# EAGLE design prj3 (EAGLE 6.6.0)
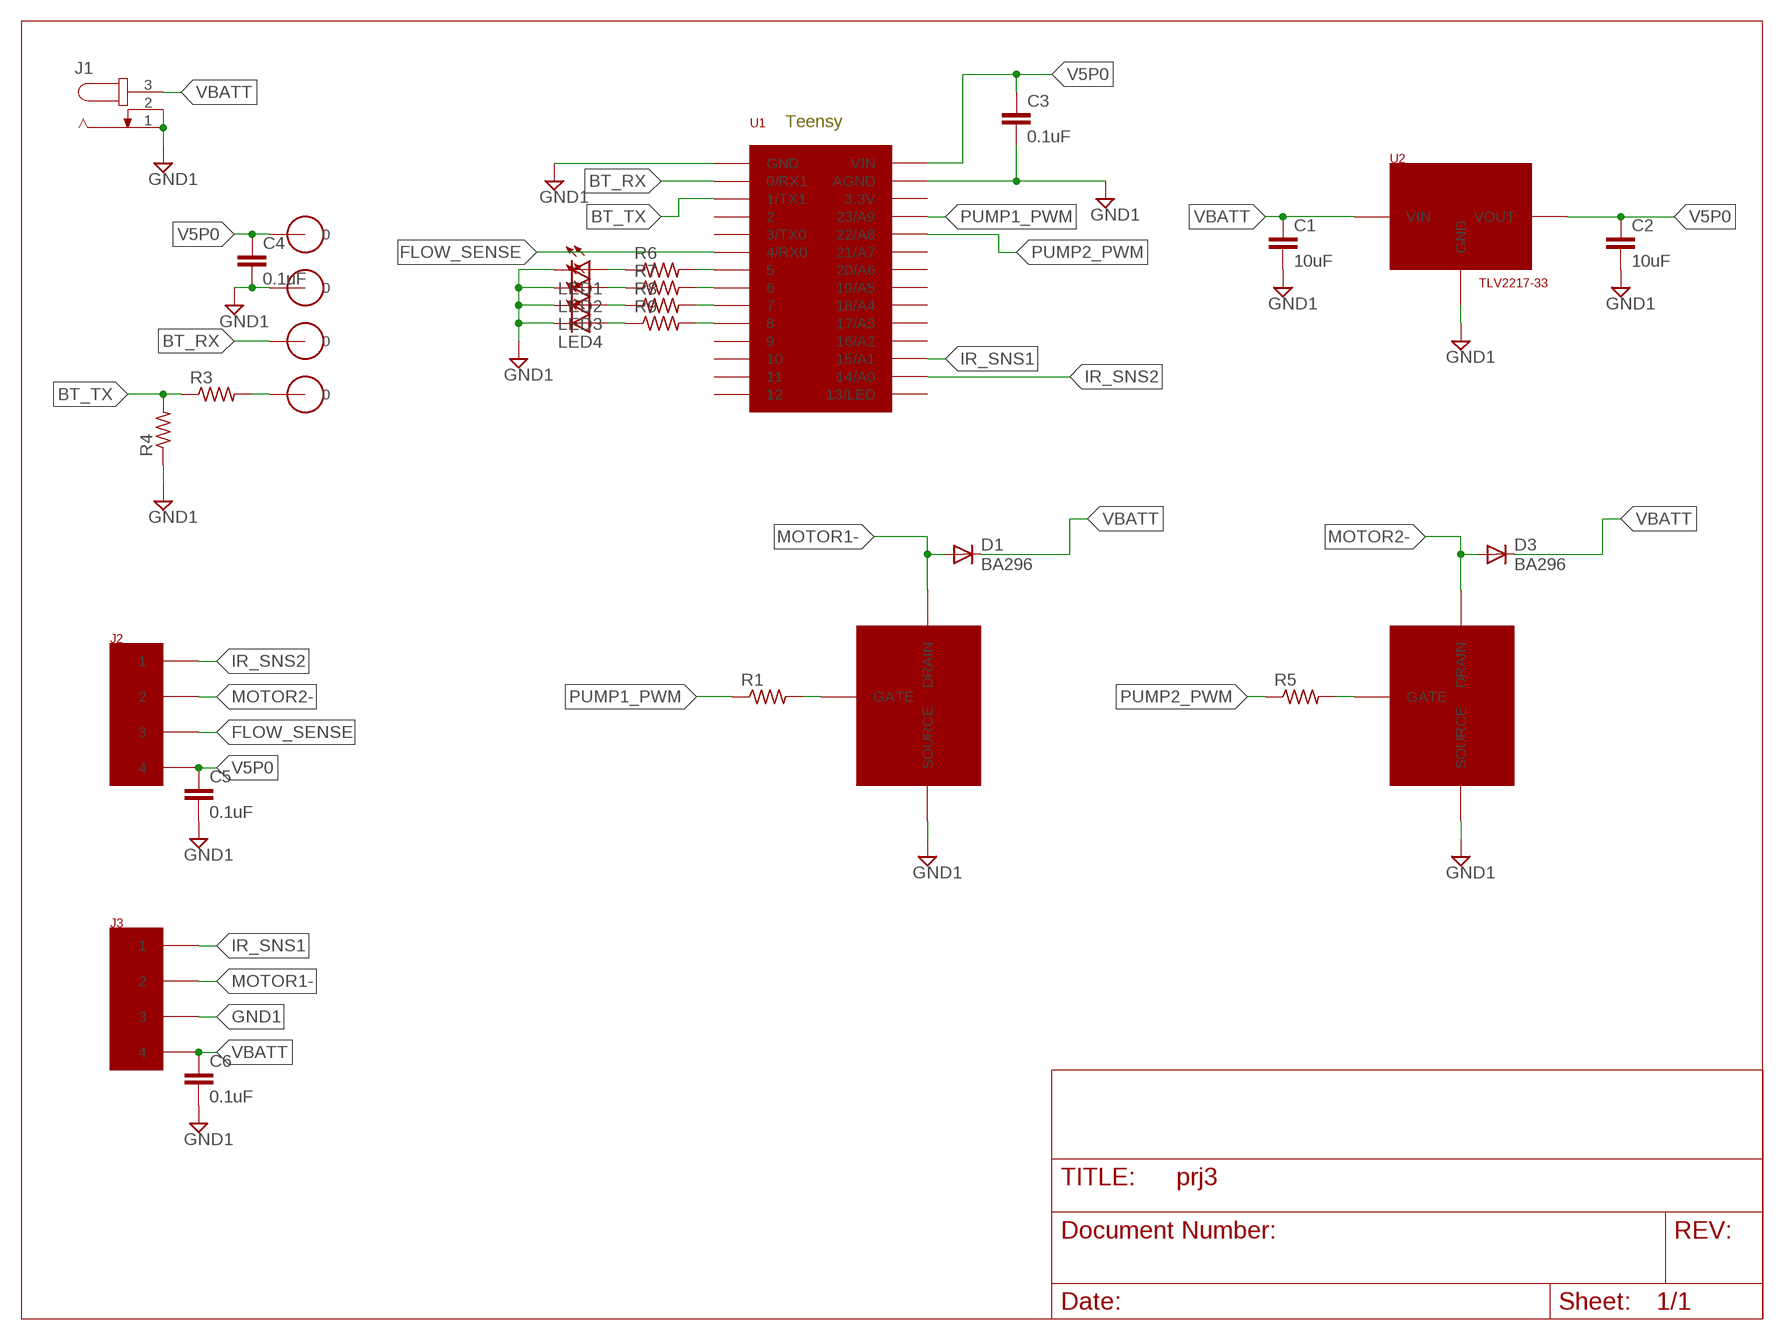
[diagram p0: schematic, sheet 1]

## Parts
C1  10uF  C2,5-3  [C2.5-3]
C2  10uF  C2,5-3  [C2.5-3]
C3  0.1uF  C2,5-3  [C2.5-3]
C4  0.1uF  C2,5-3  [C2.5-3]
C5  0.1uF  C2,5-3  [C2.5-3]
C6  0.1uF  C2,5-3  [C2.5-3]
D1  BA296  [P2-15]
D3  BA296  [P2-15]
J1  JACK-PLUG0  [SPC4077]
J2  1776119-4  [4P_SCREW_TERMINAL]
J3  1776119-4  [4P_SCREW_TERMINAL]
J7  35MIL_HOLE  [35MIL_HOLE]
J8  35MIL_HOLE  [35MIL_HOLE]
J9  35MIL_HOLE  [35MIL_HOLE]
J10  35MIL_HOLE  [35MIL_HOLE]
LED1  LED_ELD260  [LED_LD260]
LED2  LED_ELD260  [LED_LD260]
LED3  LED_ELD260  [LED_LD260]
LED4  LED_ELD260  [LED_LD260]
R1  R-US_0207/10  [0207/10]
R3  R-US_0207/10  [0207/10]
R4  R-US_0207/10  [0207/10]
R5  R-US_0207/10  [0207/10]
R6  R-US_0207/10  [0207/10]
R7  R-US_0207/10  [0207/10]
R8  R-US_0207/10  [0207/10]
R9  R-US_0207/10  [0207/10]
U1  TEENSY  [TEENSY]
U2  TLV2217-33  [TO-220]
U$2  NFET  [TO-220]
U$3  NFET  [TO-220]

## Nets
BT_RX: J9.P$1 U1.P$2(0/RX1)
BT_TX: R3.1 R4.2 U1.P$3(1/TX1)
FLOW_SENSE: J2.P$3 U1.P$6(4/RX0)
GND1: C1.2 C2.2 C3.2 C4.2 C5.2 C6.2 J1.1 J1.2 J3.P$3 J8.P$1 LED1.K(C) LED2.K(C) LED3.K(C) LED4.K(C) R4.1 U1.P$1(GND) U1.P$32(AGND) U2.2(GND) U$2.3(SOURCE) U$3.3(SOURCE)
IR_SNS1: J3.P$1 U1.P$22(15/A1)
IR_SNS2: J2.P$1 U1.P$21(14/A0)
MOTOR1-: D1.A J3.P$2 U$2.2(DRAIN)
MOTOR2-: D3.A J2.P$2 U$3.2(DRAIN)
N$4: R1.2 U$2.1(GATE)
N$6: R5.2 U$3.1(GATE)
N$7: R6.2 U1.P$7
N$8: J10.P$1 R3.2
N$9: R7.2 U1.P$8
N$10: R8.2 U1.P$9
N$11: R9.2 U1.P$10
N$12: LED1.A R6.1
N$13: LED2.A R7.1
N$14: LED3.A R8.1
N$15: LED4.A R9.1
PUMP1_PWM: R1.1 U1.P$30(23/A9)
PUMP2_PWM: R5.1 U1.P$29(22/A8)
V5P0: C2.1 C3.1 C4.1 C5.1 J2.P$4 J7.P$1 U1.P$33(VIN) U2.3(VOUT)
VBATT: C1.1 C6.1 D1.C D3.C J1.3 J3.P$4 U2.1(VIN)
Unconnected: U1.P$4 U1.P$5(3/TX0) U1.P$11 U1.P$12 U1.P$13 U1.P$14 U1.P$20(13/LED) U1.P$23(16/A2) U1.P$24(17/A3) U1.P$25(18/A4) U1.P$26(19/A5) U1.P$27(20/A6) U1.P$28(21/A7) U1.P$31(3.3V)

## Notes on the sheet
- Teensy

## Library data of the parts
C1-C6 = capacitor-wima:C: CAPACITOR naming: grid - package width
D1 D3 = diode:BA296: DIODE
J1 = mod:JACK-PLUG: DC POWER JACK Power Jack, DC, Right Angle, Through Hole, Rated 5A at 16VDC, PC Terminals Distributor: Farnell (www.Farnell.de) Drawing: 84N1161.pdf / 84N1162.pdf Manufacturer: SPC Technology (www.spctechnology.com) Type: SPC4077 / SPC 4078; OC_FARNELL: unknown; OC_NEWARK: unknown
J2 J3 = local:1776119-4
J7-J10 = local:35MIL_HOLE
LED1-LED4 = eagle-ltspice:LED_E: LED Source: http://www.osram.convergy.de Source: www.luxeon.com Source: www.kingbright.com; SPICEMODEL: NONE; SPICEPREFIX: D; SPICETYPE: diode
R1 R3-R9 = resistor:R-US_: RESISTOR, American symbol
U1 = local:TEENSY
U2 = local:TLV2217-33
U$2 U$3 = local:NFET

## Board
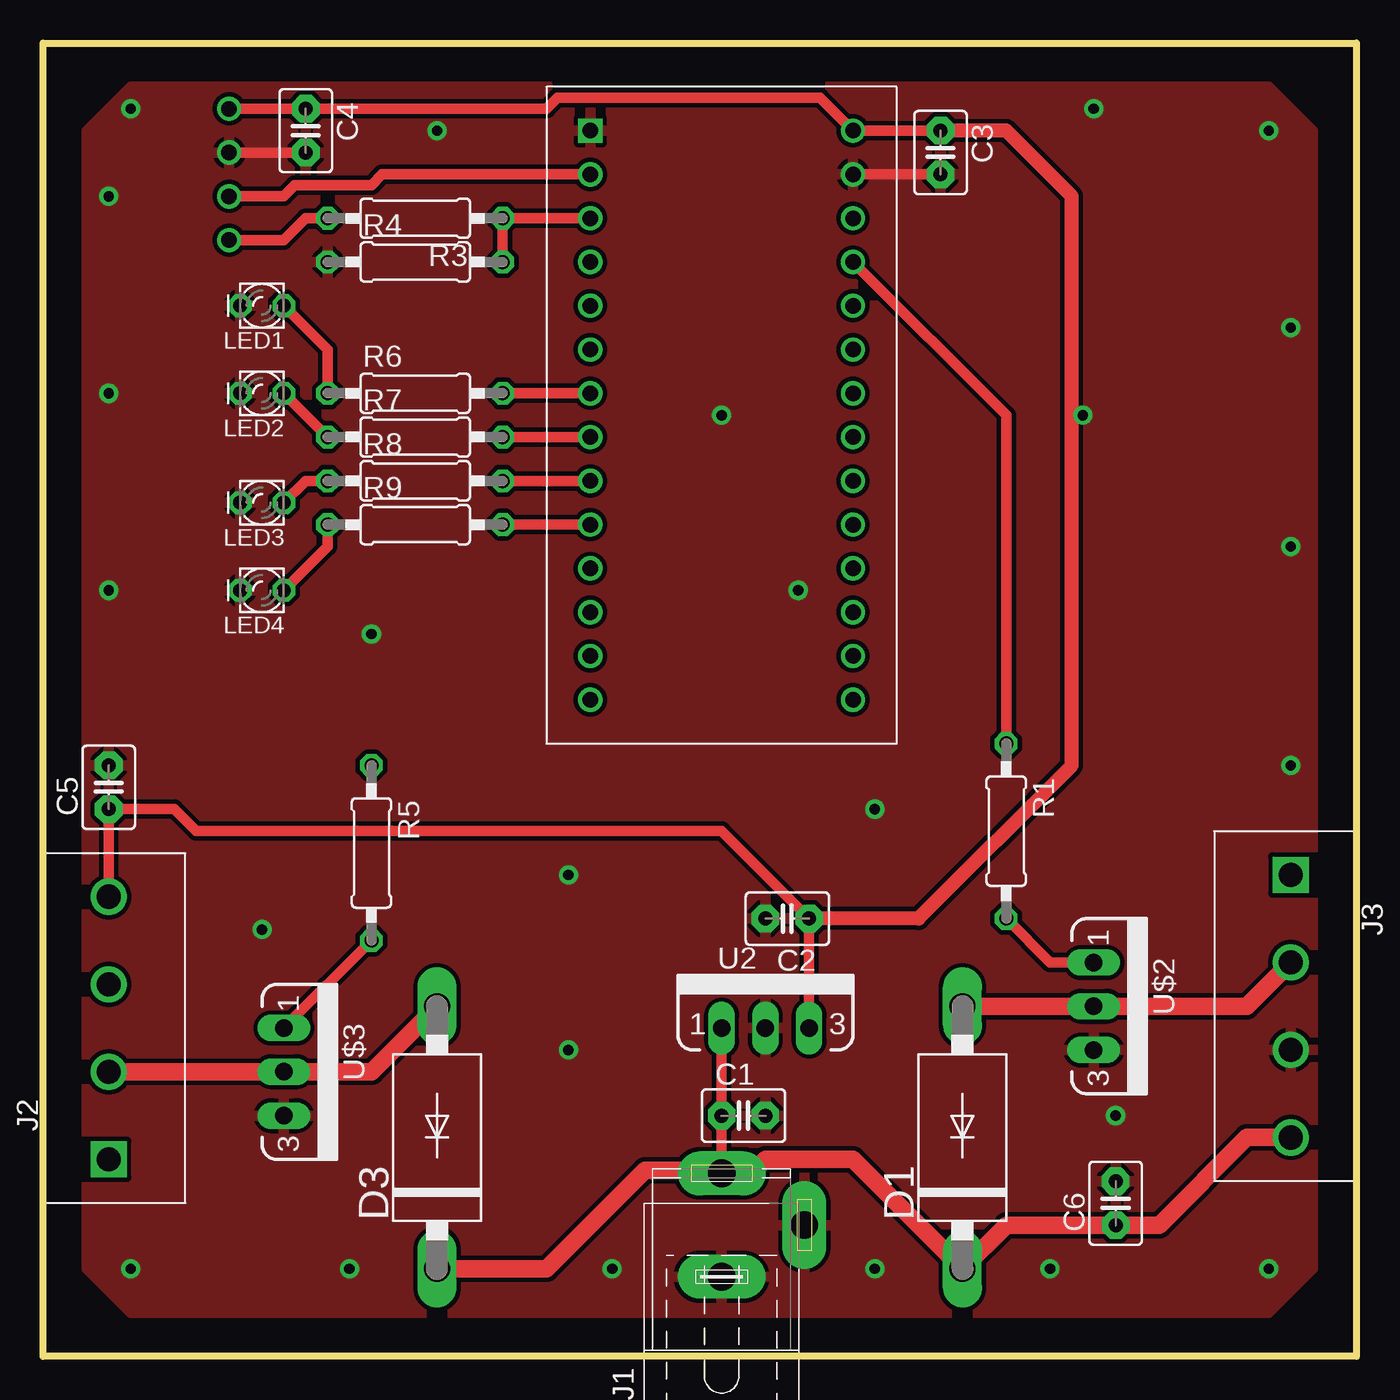
[diagram p1: board, top side]
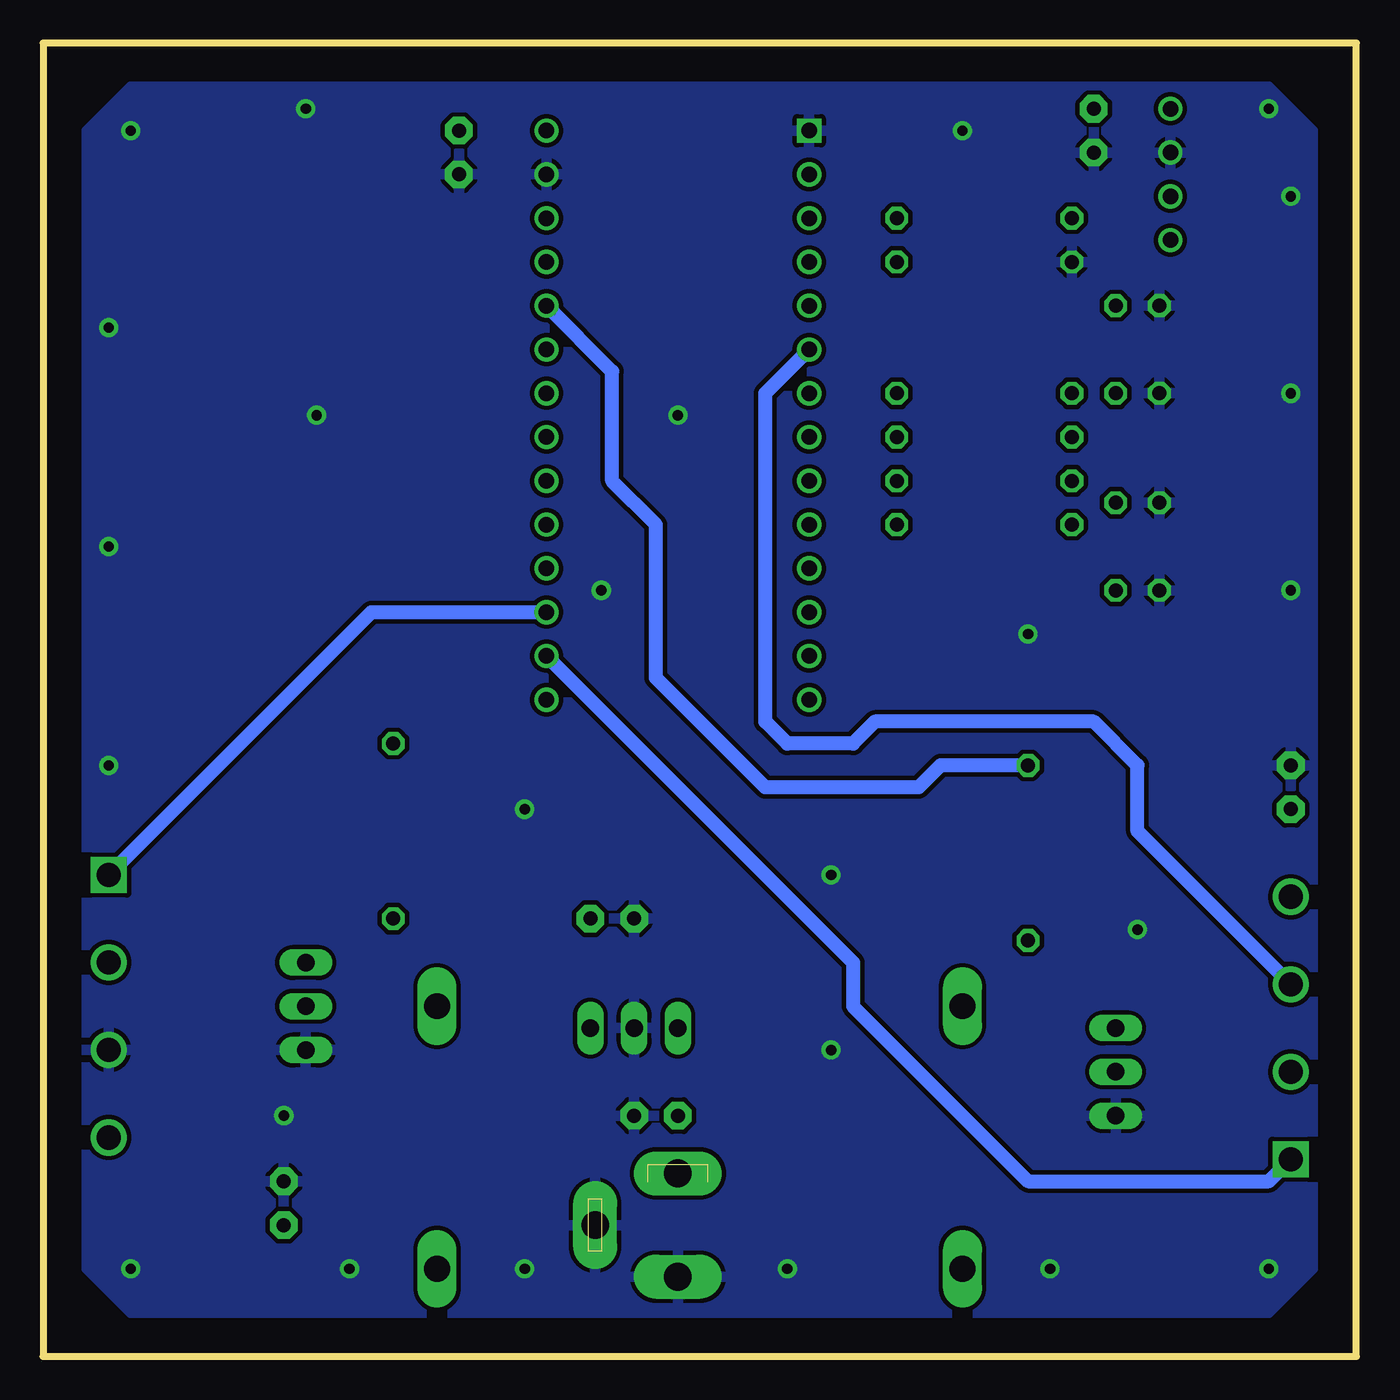
[diagram p2: board, bottom side, seen from below]

Size 76.2 x 76.2 mm. Coordinates in mm from the lower left corner, seen from the top.
Outline: 0,0 0,76.2 76.2,76.2 76.2,0 0,0
Copper layers (1*16): Top 0.035mm / dielectric 1.5mm / Bottom 0.035mm
Design rules "Express": minimum track width 15mil, minimum drill 20mil, track to track 10mil, track to pad 10mil, pad to pad 10mil, via to via 10mil, smd to smd 10mil, copper to edge 78mil, drill to drill 10mil, minimum pad ring 10mil, minimum via ring 10mil, stop-mask expansion 4mil, vias tented up to drill 0mil, thermal gap 10mil

### Footprints (pad centres in the part's own frame; a part is rotated, then mirrored left to right if it is on the bottom)
C2.5-3 = drill 0.813 pad 1.6 octagon: 1 -1.27,0; 2 1.27,0
P2-15 = drill 1.499 long: A 7.62,0; C -7.62,0
SPC4077 = drill 1.6 pad 2.54 long: 1 -3,0; 2 0,-4.8; 3 3,0
4P_SCREW_TERMINAL = drill 1.4 square: P$1 0,0 | drill 1.4: P$2 5.08,0; P$3 10.16,0; P$4 15.24,0
35MIL_HOLE = drill 0.9: P$1 0,0
LED_LD260 = drill 0.813 octagon: A -1.27,0; K 1.27,0
0207/10 = drill 0.813 octagon: 1 -5.08,0; 2 5.08,0
TEENSY = drill 0.9 square: P$1 0,0 | drill 0.9: P$2 0,-2.54; P$3 0,-5.08; P$4 0,-7.62; P$5 0,-10.16; P$6 0,-12.7; P$7 0,-15.24; P$8 0,-17.78; P$9 0,-20.32; P$10 0,-22.86; P$11 0,-25.4; P$12 0,-27.94; P$13 0,-30.48; P$14 0,-33.02; P$20 15.24,-33.02; P$21 15.24,-30.48; P$22 15.24,-27.94; P$23 15.24,-25.4; P$24 15.24,-22.86; P$25 15.24,-20.32; P$26 15.24,-17.78; P$27 15.24,-15.24; P$28 15.24,-12.7; P$29 15.24,-10.16; P$30 15.24,-7.62; P$31 15.24,-5.08; P$32 15.24,-2.54; P$33 15.24,0
TO-220 = drill 1.016 long: 1 -2.54,0; 2 0,0; 3 2.54,0

### Placement (x,y rotation side)
C1  40.64,13.97 0 top
C2  43.18,25.4 180 top
C3  52.07,69.85 270 top
C4  15.24,71.12 270 top
C5  3.81,33.02 90 top
C6  62.23,8.89 90 top
D1  53.34,12.7 90 top
D3  22.86,12.7 90 top
J1  39.37,7.62 90 top
J2  3.81,11.43 90 top
J3  72.39,27.94 270 top
J7  10.79,72.39 90 top
J8  10.79,69.85 90 top
J9  10.79,67.31 90 top
J10  10.79,64.77 90 top
LED1  12.7,60.96 180 top
LED2  12.7,55.88 180 top
LED3  12.7,49.53 180 top
LED4  12.7,44.45 180 top
R1  55.88,30.48 270 top
R3  21.59,66.04 180 top
R4  21.59,63.5 0 top
R5  19.05,29.21 270 top
R6  21.59,55.88 0 top
R7  21.59,53.34 0 top
R8  21.59,50.8 0 top
R9  21.59,48.26 0 top
U1  31.75,71.12 0 top
U2  41.91,19.05 0 top
U$2  60.96,20.32 270 top
U$3  13.97,16.51 270 top

### Tracks (layer width: path | path; a pad name or v marks a point on that pad's centre or on a via)
BT_RX
  Top 0.61: J9.P$1 13.97,67.31 14.61,67.94 19.05,67.94 19.68,68.58 U1.P$2
BT_TX
  Top 0.61: U1.P$3 R3.1 R4.2
FLOW_SENSE
  Bottom 0.813: J2.P$3 12.7,30.48 12.7,34.29 15.24,36.83 27.94,36.83 29.21,35.56 33.02,35.56 34.29,36.83 34.29,55.88 U1.P$6
GND1  (via drill 0.6)
  Top 0.61: J8.P$1 C4.2 | C3.2 U1.P$32
  other vias: 71.12,5.08 58.42,5.08 48.26,5.08 33.02,5.08 17.78,5.08 5.08,5.08 30.48,17.78 62.23,13.97 72.39,34.29 72.39,46.99 71.12,71.12 72.39,59.69 60.96,72.39 22.86,71.12 5.08,72.39 3.81,67.31 3.81,55.88 3.81,44.45 39.37,54.61 19.05,41.91 30.48,27.94 48.26,31.75 43.81,44.45 60.33,54.61 12.7,24.77
  pour Top: 5.08,2.54 2.54,5.08 2.54,71.12 5.08,73.66 7.62,73.66 71.12,73.66 73.66,71.12 73.66,5.08 71.12,2.54
  pour Top: 5.08,2.54 2.54,5.08 2.54,71.12 5.08,73.66 7.62,73.66 71.12,73.66 73.66,71.12 73.66,5.08 71.12,2.54
  pour Bottom: 5.08,2.54 2.54,5.08 2.54,71.12 5.08,73.66 7.62,73.66 71.12,73.66 73.66,71.12 73.66,5.08 71.12,2.54
IR_SNS1
  Bottom 0.813: J3.P$1 57.15,43.18 U1.P$22
IR_SNS2
  Bottom 0.813: U1.P$21 29.21,22.86 29.21,20.32 19.05,10.16 5.08,10.16 J2.P$1
MOTOR1-
  Top 1.016: J3.P$2 69.85,20.32 U$2.2 D1.A
MOTOR2-
  Top 1.016: J2.P$2 U$3.2 19.05,16.51 D3.A
N$4
  Top 0.61: U$2.1 58.42,22.86 R1.2
N$6
  Top 0.61: U$3.1 R5.2
N$7
  Top 0.61: R6.2 U1.P$7
N$8
  Top 0.61: J10.P$1 13.97,64.77 15.24,66.04 R3.2
N$9
  Top 0.61: U1.P$8 R7.2
N$10
  Top 0.61: U1.P$9 R8.2
N$11
  Top 0.61: U1.P$10 R9.2
N$12
  Top 0.61: R6.1 16.51,58.42 LED1.A
N$13
  Top 0.61: R7.1 LED2.A
N$14
  Top 0.61: R8.1 15.24,50.8 LED3.A
N$15
  Top 0.61: R9.1 16.51,46.99 LED4.A
PUMP1_PWM
  Top 0.61: R1.1 55.88,54.61 U1.P$30
PUMP2_PWM
  Bottom 0.813: R5.1 24.13,34.29 25.4,33.02 34.29,33.02 40.64,39.37 40.64,48.26 43.18,50.8 43.18,57.15 U1.P$29
V5P0
  Top 0.61: J7.P$1 C4.1 29.21,72.39 29.84,73.03 45.09,73.03 U1.P$33 C3.1 | J2.P$4 C5.1 7.62,31.75 8.89,30.48 39.37,30.48 C2.1 U2.3
  Top 0.813: C3.1 55.88,71.12 59.69,67.31 59.69,34.29 50.8,25.4 C2.1
VBATT
  Top 0.61: J1.3 39.37,10.16 38.73,10.16 38.1,10.79 | U2.1 C1.1 J1.3 | 39.55,10.79 J1.3
  Top 1.016: D3.C 29.21,5.08 34.92,10.79 39.2,10.79 J1.3 | 39.55,10.79 41.27,10.79 41.91,11.43 46.99,11.43 D1.C 55.88,7.62 C6.1 | 63.5,7.62 C6.1 | C6.1 64.77,7.62 69.85,12.7 J3.P$4